# EAGLE design WS2812Bv1 (EAGLE 5.06)
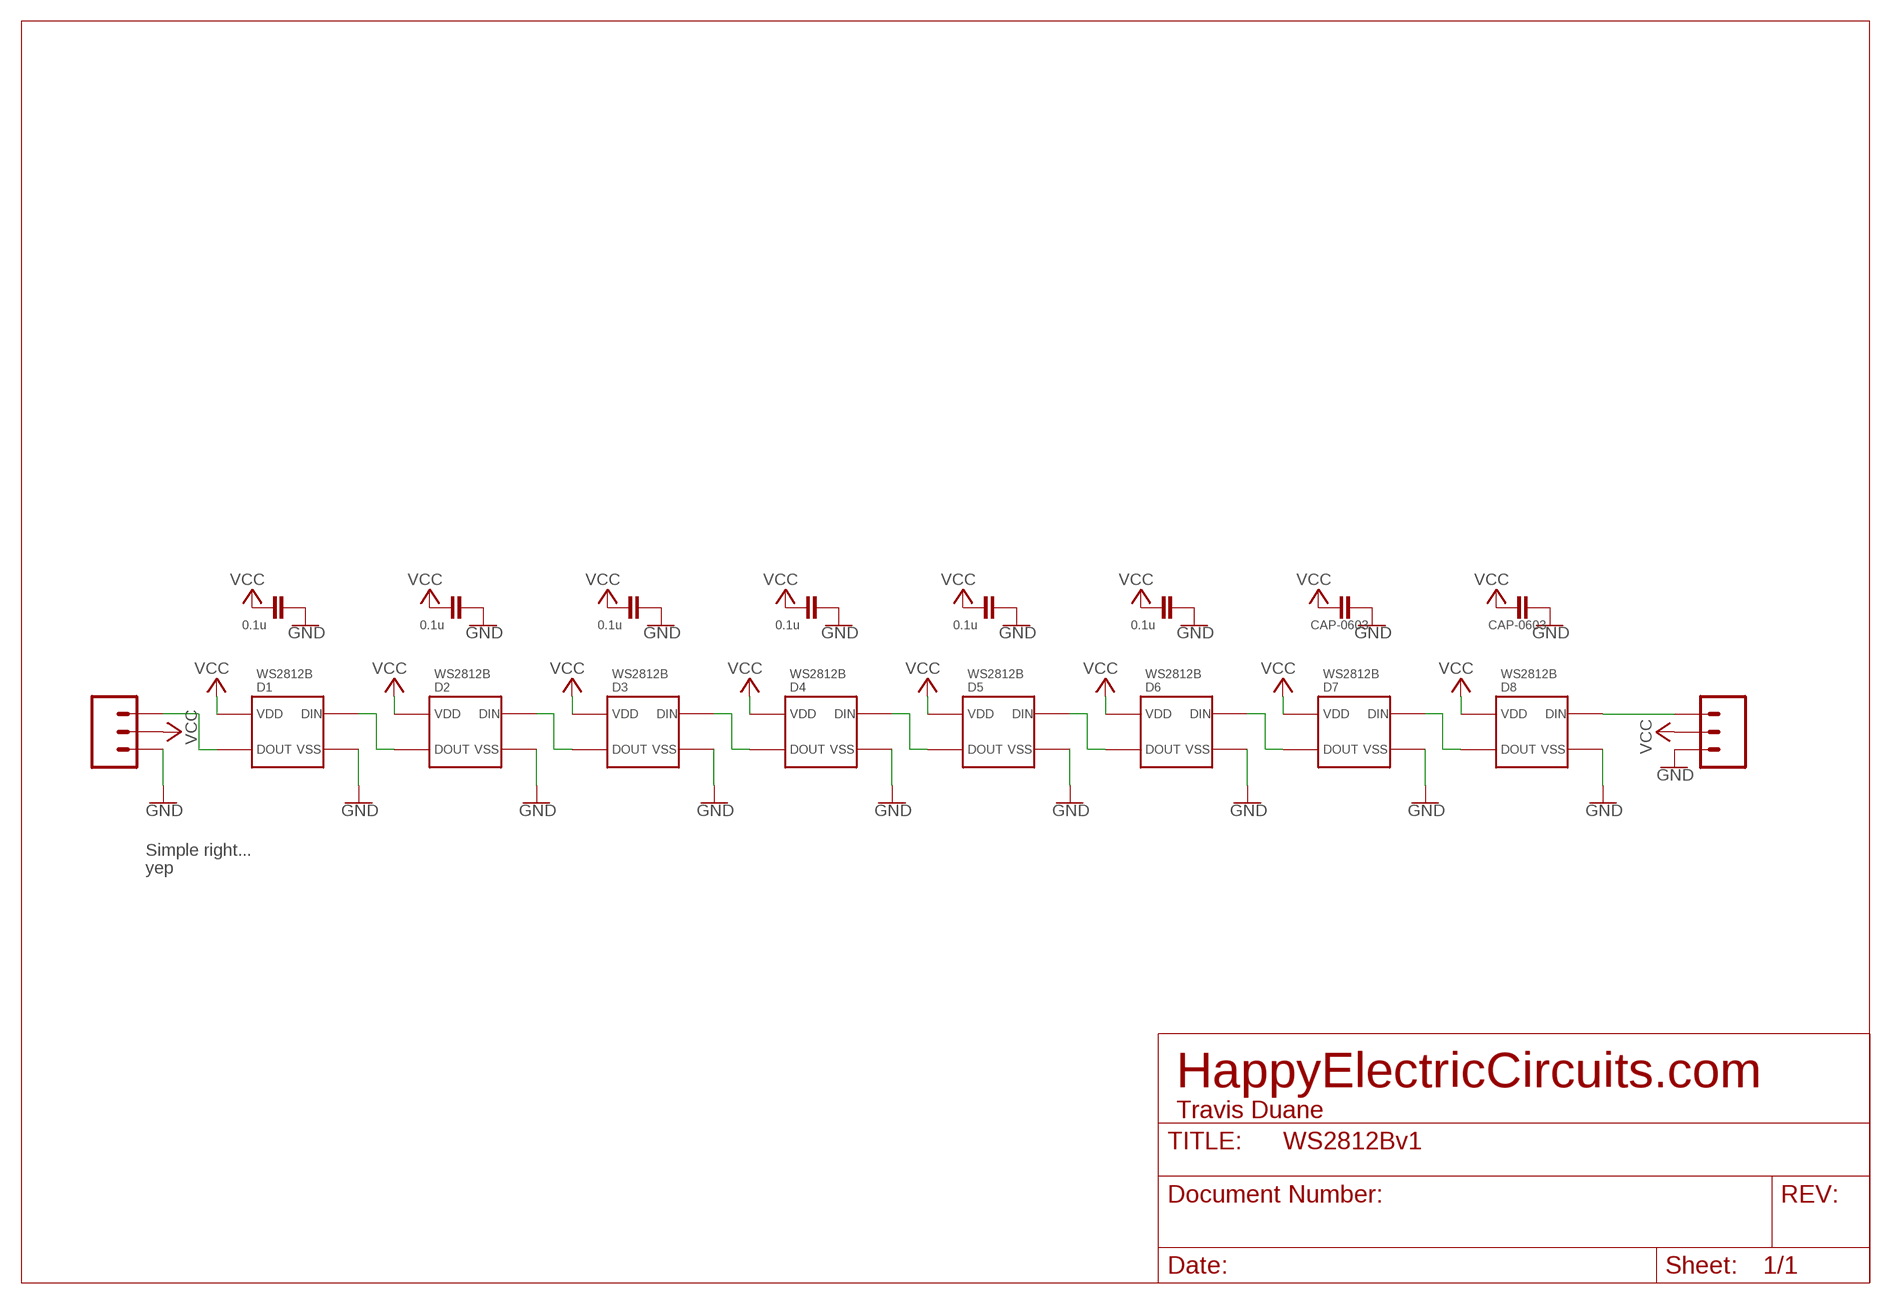
[diagram p0: schematic, sheet 1]

## Parts
C1  0.1u  CAP-0603  [0603-CAP]
C2  0.1u  CAP-0603  [0603-CAP]
C3  0.1u  CAP-0603  [0603-CAP]
C4  0.1u  CAP-0603  [0603-CAP]
C5  0.1u  CAP-0603  [0603-CAP]
C6  0.1u  CAP-0603  [0603-CAP]
C7  CAP-0603  [0603-CAP]
C8  CAP-0603  [0603-CAP]
D1  WS2812B  [5050-4]
D2  WS2812B  [5050-4]
D3  WS2812B  [5050-4]
D4  WS2812B  [5050-4]
D5  WS2812B  [5050-4]
D6  WS2812B  [5050-4]
D7  WS2812B  [5050-4]
D8  WS2812B  [5050-4]
J1  M03  [M03]
J2  M03  [M03]

## Nets
DIN: D8.DIN J1.1
DOUT: D1.DOUT J2.3
GND: C1.4 C2.4 C3.4 C4.4 C5.4 C6.4 C7.4 C8.4 D1.VSS D2.VSS D3.VSS D4.VSS D5.VSS D6.VSS D7.VSS D8.VSS J1.3 J2.1
N$1: D1.DIN D2.DOUT
N$2: D2.DIN D3.DOUT
N$3: D3.DIN D4.DOUT
N$4: D4.DIN D5.DOUT
N$5: D5.DIN D6.DOUT
N$6: D6.DIN D7.DOUT
N$7: D7.DIN D8.DOUT
VCC: C1.3 C2.3 C3.3 C4.3 C5.3 C6.3 C7.3 C8.3 D1.VDD D2.VDD D3.VDD D4.VDD D5.VDD D6.VDD D7.VDD D8.VDD J1.2 J2.2

## Notes on the sheet
- Simple right...
- yep
- HappyElectricCircuits.com
- Travis Duane

## Library data of the parts
C1-C8 = Travis:CAP-0603
D1-D8 = Travis:WS2812B: Intelligent controlled LED
J1 J2 = Travis:M03

## Board
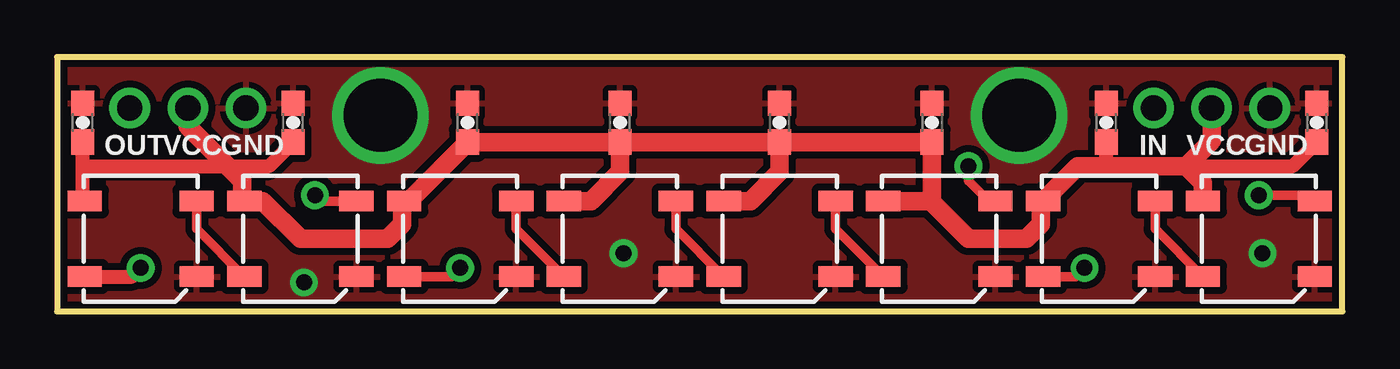
[diagram p1: board, top side]
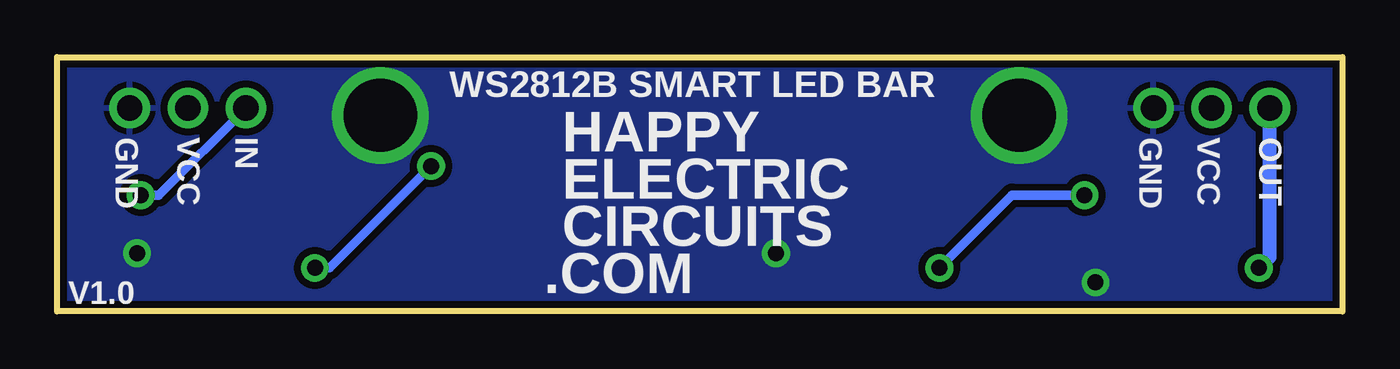
[diagram p2: board, bottom side, seen from below]

Size 56.2 x 11.11 mm. Coordinates in mm from the lower left corner, seen from the top.
Outline: 0,0 56.2,0 56.2,11.11 0,11.11 0,0
Copper layers (1*16): Top 0.035mm / dielectric 1.5mm / Bottom 0.035mm
Design rules "SparkFun *": minimum track width 8mil, minimum drill 20mil, track to track 8mil, track to pad 8mil, pad to pad 8mil, via to via 8mil, smd to smd 8mil, copper to edge 10mil, drill to drill 8mil, minimum pad ring 12mil, minimum via ring 10mil, stop-mask expansion 4mil, vias tented up to drill 28mil, thermal gap 10mil

### Footprints (pad centres in the part's own frame; a part is rotated, then mirrored left to right if it is on the bottom)
0603-CAP = smd 1.1 x 1: 3 -0.85,0; 4 0.85,0
5050-4 = smd 1.5 x 0.9: DIN 2.45,1.65; DOUT -2.45,-1.65; VDD -2.45,1.65; VSS 2.45,-1.65
M03 = drill 1.1 pad 1.778 round: 1 0,0; 2 0,-2.54; 3 0,-5.08

### Placement (x,y rotation side)
C1  10.32,8.26 90 top
C2  24.61,8.26 90 top
C3  31.59,8.26 90 top
C4  38.26,8.26 90 top
C5  55.09,8.26 90 top
C6  45.88,8.26 90 top
C7  1.11,8.26 90 top
C8  17.94,8.26 90 top
D1  3.65,3.17 0 top
D2  10.64,3.17 0 top
D3  17.62,3.17 0 top
D4  24.61,3.17 0 top
D5  31.59,3.17 0 top
D6  38.58,3.17 0 top
D7  45.56,3.17 0 top
D8  52.55,3.17 0 top
J1  47.94,8.89 90 top
J2  8.25,8.89 270 top

### Tracks (layer width: path | path; a pad name or v marks a point on that pad's centre or on a via)
DIN  (via drill 0.7)
  Top 0.406: v52.55,5.08 54.74,5.08 arc-90 D8.DIN
  Bottom 0.406: J1.1 51.75,5.08 v52.55,5.08
DOUT  (via drill 0.7)
  Top 0.61: v3.65,1.91 3.27,1.52 D1.DOUT
  Bottom 0.61: J2.3 3.17,2.38 v3.65,1.91
GND  (via drill 0.7, 3.2, 3.2 pad 1.42)
  Top 0.305: D2.VSS 13.18,1.44 | D1.VSS arc-90 6.19,1.44
  other vias: 14.13,8.57 42.07,8.57 10.79,1.27 24.77,2.54 52.7,2.54
  pour Top (isolate 0.305): 0.32,10.79 0.32,0.32 55.88,0.32 55.88,10.79
  pour Bottom (isolate 0.305): 0.32,10.79 0.32,0.32 55.88,0.32 55.88,10.79
N$1
  Top 0.406: D1.DIN 6.1,3.61 D2.DOUT
N$2  (via drill 0.7)
  Top 0.406: D2.DIN 11.53,4.83 v11.27,5.08 | v17.62,1.91 17.24,1.52 D3.DOUT
  Bottom 0.406: v11.27,5.08 14.45,5.08 v17.62,1.91
N$3
  Top 0.406: D3.DIN 20.07,3.61 D4.DOUT
N$4
  Top 0.406: D4.DIN 27.06,3.61 D5.DOUT
N$5
  Top 0.406: D5.DIN 34.04,3.61 D6.DOUT
N$6  (via drill 0.7)
  Top 0.406: v39.85,6.35 39.85,5.71 40.74,4.83 D6.DIN | v44.93,1.91 44.55,1.52 D7.DOUT
  Bottom 0.406: v39.85,6.35 44.29,1.91 v44.93,1.91
N$7
  Top 0.406: D7.DIN 48.01,3.61 D8.DOUT
VCC
  Top 0.406: 1.2,7.32 C7.3
  Top 0.61: 1.2,7.32 1.11,7.22 1.11,6.35 | 1.11,6.35 7.46,6.35 9.26,6.35 C1.3 | D1.VDD arc-90 1.11,4.92 1.11,6.35 | 45.88,6.35 C6.3 | 45.88,6.35 | C5.3 54.03,6.35 49.21,6.35
  Top 0.813: C2.3 C8.3 15.36,4.83 D3.VDD 15.08,4.74 15.08,3.81 14.45,3.17 10.64,3.17 8.99,4.83 D2.VDD 8.1,4.92 8.1,5.71 7.46,6.35 5.71,8.1 J2.2 | C2.3 C3.3 | C3.3 C4.3 38.26,5.08 | C3.3 31.59,6.09 30.32,4.83 D5.VDD | C2.3 24.61,6.09 23.34,4.83 D4.VDD | D6.VDD 38.26,4.83 38.26,5.08 | 38.26,5.08 38.26,4.76 39.85,3.17 42.39,3.17 43.02,3.81 43.02,4.74 arc-90 D7.VDD 44.64,6.35 45.88,6.35 49.21,6.35 49.37,6.35 | J1.2 50.48,7.46 49.37,6.35 | D8.VDD 50.1,5.62 49.37,6.35

### Text on the board
tPlace: OUT | VCC | GND | IN | VCC | GND
bPlace: WS2812B SMART LED BAR | OUT | VCC | GND | IN | VCC | GND | HAPPY | ELECTRIC | CIRCUITS | .COM | V1.0